# EAGLE design guest room controller V1 (EAGLE 7.2.0)
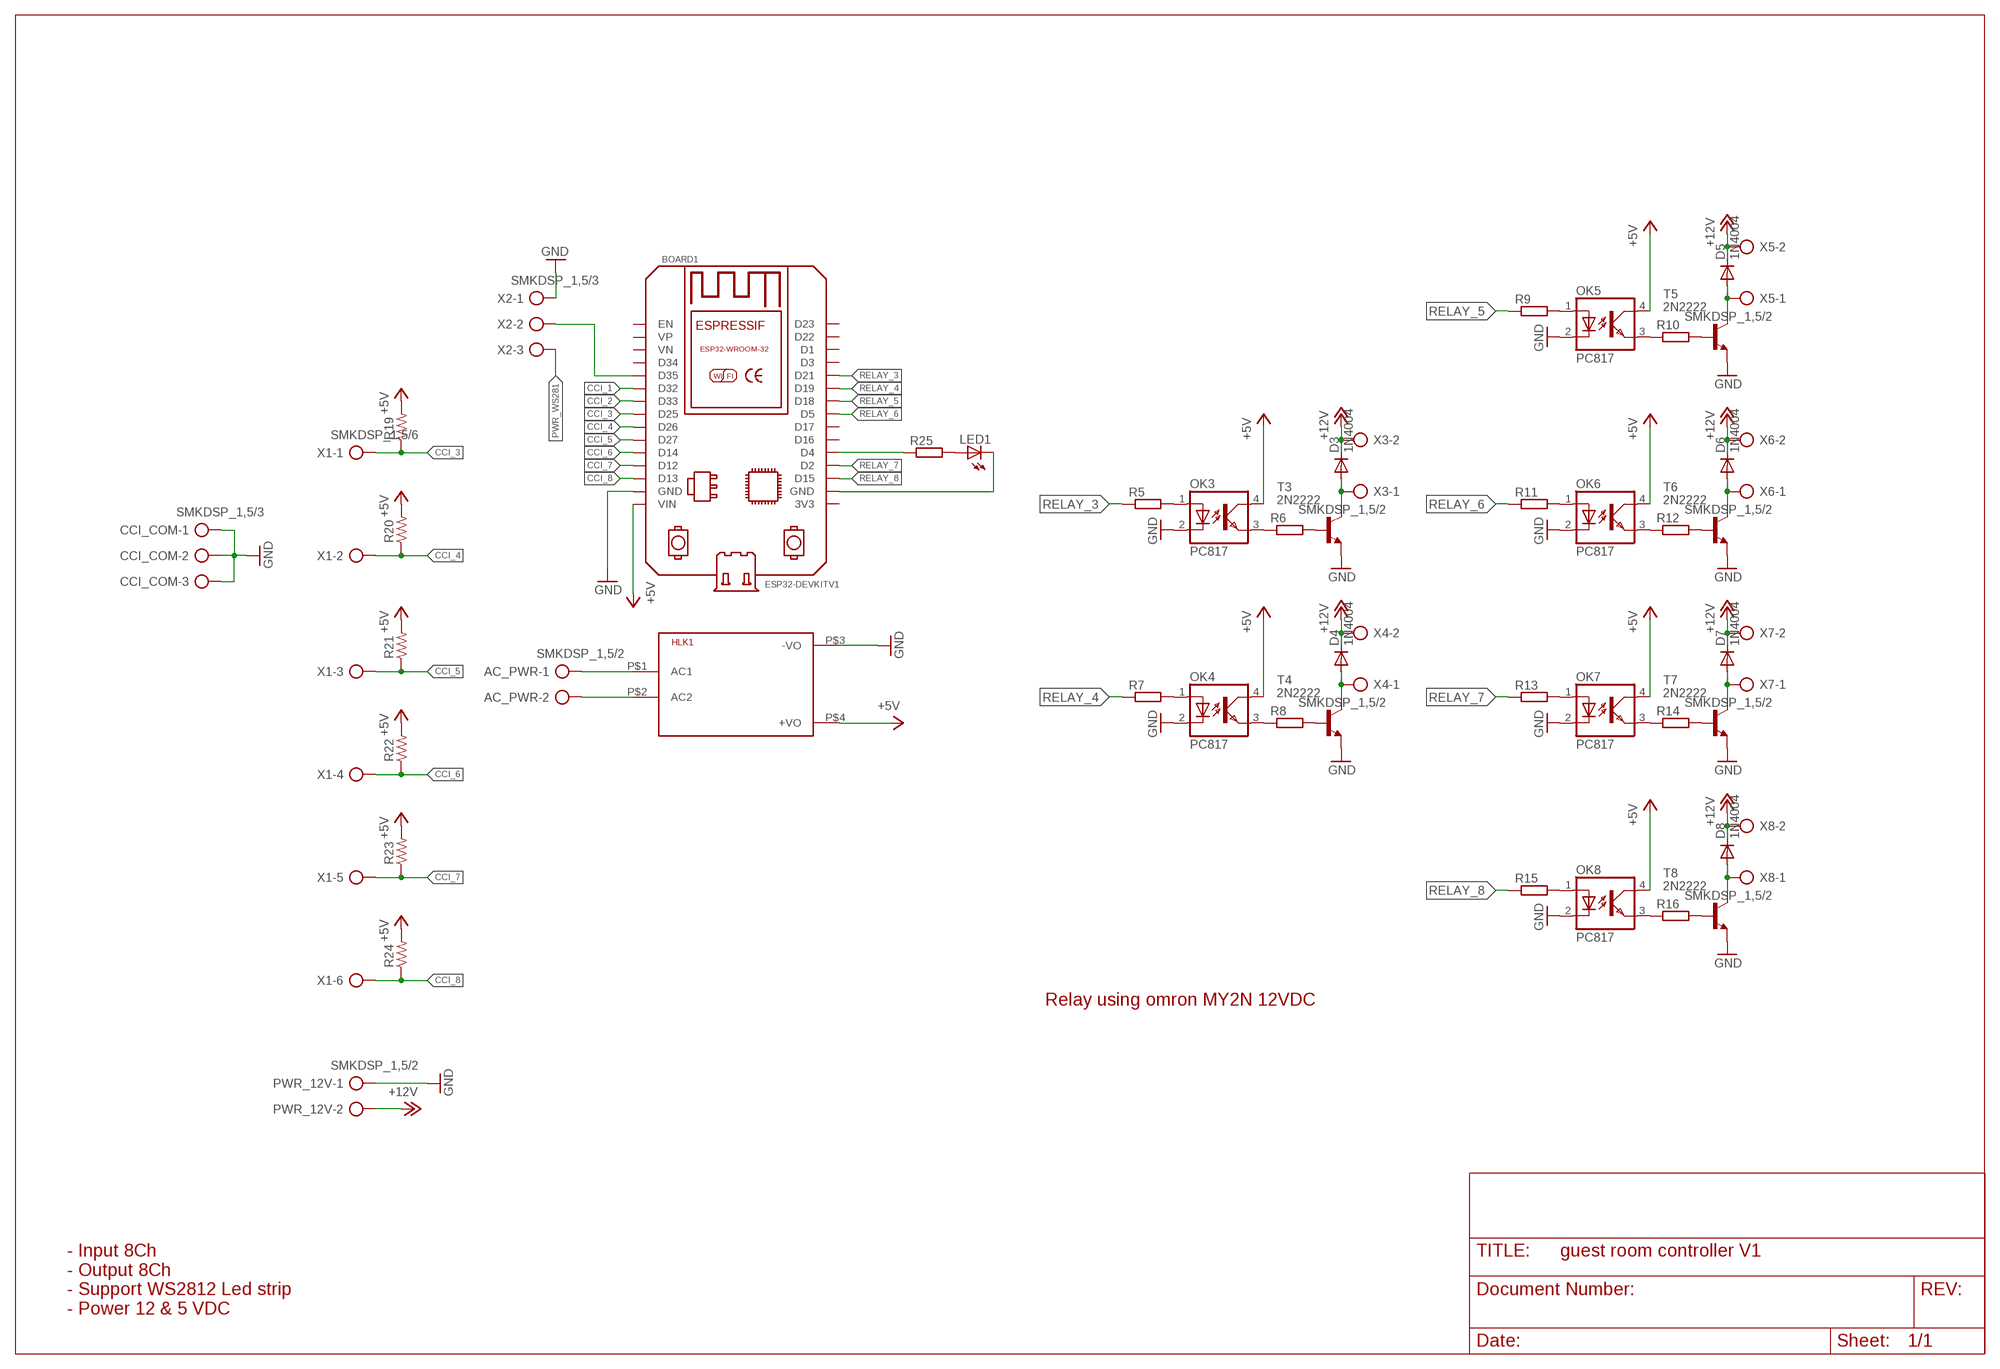
[diagram p0: schematic, sheet 1]

## Parts
AC_PWR  SMKDSP_1,5/2  [SMKDSP_1,5/2]
BOARD1  ESP32DEVKITV1  [ESP32-DEVKITV1]
CCI_COM  SMKDSP_1,5/3  [SMKDSP_1,5/3]
D3  1N4004  [DO41-10]
D4  1N4004  [DO41-10]
D5  1N4004  [DO41-10]
D6  1N4004  [DO41-10]
D7  1N4004  [DO41-10]
D8  1N4004  [DO41-10]
HLK1  HLK-PM013W  [HLK-PM01]
LED1  LED3MM  [LED3MM]
OK3  PC817  [DIL04]
OK4  PC817  [DIL04]
OK5  PC817  [DIL04]
OK6  PC817  [DIL04]
OK7  PC817  [DIL04]
OK8  PC817  [DIL04]
PWR_12V  SMKDSP_1,5/2  [SMKDSP_1,5/2]
R5  R-EU_0207/10  [0207/10]
R6  R-EU_0207/10  [0207/10]
R7  R-EU_0207/10  [0207/10]
R8  R-EU_0207/10  [0207/10]
R9  R-EU_0207/10  [0207/10]
R10  R-EU_0207/10  [0207/10]
R11  R-EU_0207/10  [0207/10]
R12  R-EU_0207/10  [0207/10]
R13  R-EU_0207/10  [0207/10]
R14  R-EU_0207/10  [0207/10]
R15  R-EU_0207/10  [0207/10]
R16  R-EU_0207/10  [0207/10]
R19  R_1206  [R1206]
R20  R_1206  [R1206]
R21  R_1206  [R1206]
R22  R_1206  [R1206]
R23  R_1206  [R1206]
R24  R_1206  [R1206]
R25  R-EU_0207/10  [0207/10]
T3  2N2222  [TO18]
T4  2N2222  [TO18]
T5  2N2222  [TO18]
T6  2N2222  [TO18]
T7  2N2222  [TO18]
T8  2N2222  [TO18]
X1  SMKDSP_1,5/6  [SMKDSP_1,5/6]
X2  SMKDSP_1,5/3  [SMKDSP_1,5/3]
X3  SMKDSP_1,5/2  [SMKDSP_1,5/2]
X4  SMKDSP_1,5/2  [SMKDSP_1,5/2]
X5  SMKDSP_1,5/2  [SMKDSP_1,5/2]
X6  SMKDSP_1,5/2  [SMKDSP_1,5/2]
X7  SMKDSP_1,5/2  [SMKDSP_1,5/2]
X8  SMKDSP_1,5/2  [SMKDSP_1,5/2]

## Nets
+5V: BOARD1.VIN HLK1.P$4(+VO) OK3.4(COL) OK4.4(COL) OK5.4(COL) OK6.4(COL) OK7.4(COL) OK8.4(COL) R19.2 R20.2 R21.2 R22.2 R23.2 R24.2
+12V: D3.C D4.C D5.C D6.C D7.C D8.C PWR_12V.2 X3.2 X4.2 X5.2 X6.2 X7.2 X8.2
CCI_1: BOARD1.D32
CCI_2: BOARD1.D33
CCI_3: BOARD1.D25 R19.1 X1.1
CCI_4: BOARD1.D26 R20.1 X1.2
CCI_5: BOARD1.D27 R21.1 X1.3
CCI_6: BOARD1.D14 R22.1 X1.4
CCI_7: BOARD1.D12 R23.1 X1.5
CCI_8: BOARD1.D13 R24.1 X1.6
GND: BOARD1.GND CCI_COM.1 CCI_COM.2 CCI_COM.3 HLK1.P$3(-VO) OK3.2(C) OK4.2(C) OK5.2(C) OK6.2(C) OK7.2(C) OK8.2(C) PWR_12V.1 T3.1(E) T4.1(E) T5.1(E) T6.1(E) T7.1(E) T8.1(E) X2.1
N$7: OK3.3(EMIT) R6.1
N$8: R6.2 T3.2(B)
N$9: D3.A T3.3(C) X3.1
N$10: OK4.3(EMIT) R8.1
N$11: R8.2 T4.2(B)
N$12: D4.A T4.3(C) X4.1
N$13: OK5.3(EMIT) R10.1
N$14: R10.2 T5.2(B)
N$15: D5.A T5.3(C) X5.1
N$16: OK6.3(EMIT) R12.1
N$17: R12.2 T6.2(B)
N$18: D6.A T6.3(C) X6.1
N$19: OK7.3(EMIT) R14.1
N$20: R14.2 T7.2(B)
N$21: D7.A T7.3(C) X7.1
N$22: OK8.3(EMIT) R16.1
N$23: R16.2 T8.2(B)
N$24: D8.A T8.3(C) X8.1
N$25: AC_PWR.1 HLK1.P$1(AC1)
N$28: OK3.1(A) R5.2
N$29: OK4.1(A) R7.2
N$30: OK5.1(A) R9.2
N$31: OK6.1(A) R11.2
N$32: OK7.1(A) R13.2
N$33: OK8.1(A) R15.2
N$35: BOARD1.D4 R25.1
N$36: LED1.A R25.2
N$37: BOARD1.GND@1(GND) LED1.K(C)
N$38: BOARD1.D35 X2.2
N$39: AC_PWR.2 HLK1.P$2(AC2)
PWR_WS281: X2.3
RELAY_3: BOARD1.D21 R5.1
RELAY_4: BOARD1.D19 R7.1
RELAY_5: BOARD1.D18 R9.1
RELAY_6: BOARD1.D5 R11.1
RELAY_7: BOARD1.D2 R13.1
RELAY_8: BOARD1.D15 R15.1
Unconnected: BOARD1.3V3 BOARD1.D1 BOARD1.D3 BOARD1.D16 BOARD1.D17 BOARD1.D22 BOARD1.D23 BOARD1.D34 BOARD1.EN BOARD1.VN BOARD1.VP

## Notes on the sheet
- Relay using omron MY2N 12VDC
- - Input 8Ch
  - Output 8Ch
  - Support WS2812 Led strip
  - Power 12 & 5 VDC

## Library data of the parts
AC_PWR PWR_12V X3-X8 = con-phoenix-smkdsp:SMKDSP_1,5/2: Printklemme, Nennstrom: 17,5 A, Bemessungsspannung: 250 V, Raster: 5,0 mm Source: http://eshop.phoenixcontact.de .. 1733415.pdf; MF: FARNELL; MPN: 1733570; OC_FARNELL: 3041244; OC_NEWARK: 69C8588
BOARD1 = ESP32-DEVKITV1:ESP32DEVKITV1: https://github.com/shridattdudhat
CCI_COM X2 = con-phoenix-smkdsp:SMKDSP_1,5/3: Printklemme, Nennstrom: 17,5 A, Bemessungsspannung: 250 V, Raster: 5,0 mm Source: http://eshop.phoenixcontact.de .. 1733415.pdf; MF: FARNELL; MPN: 1733583; OC_FARNELL: 3041256; OC_NEWARK: 71C4130
D3-D8 = diode:1N4004: DIODE general purpose rectifier, 1 A
HLK1 = HLK-PM01:HLK-PM01: Hi-Link Power Supply HLK-PM01 3W Author: Ahmed Said <https://github.com/AhmedSaid/EAGLELibraries>
LED1 = led:LED: LED OSRAM: - CHIPLED LG R971, LG N971, LY N971, LG Q971, LY Q971, LO R971, LY R971 LH N974, LH R974 LS Q976, LO Q976, LY Q976 LO Q996 - Hyper CHIPLED LW Q18S LB Q993, LB Q99A, LB R99A - SideLED LS A670, LO A670, LY A670, LG A670, LP A670 LB A673, LV A673, LT A673, LW A673 LH A674 LY A675 LS A676, LA A676, LO A676, LY A676, LW A676 LS A679, LY A679, LG A679 - Hyper Micro SIDELED® LS Y876, LA Y876, LO Y876, LY Y876 LT Y87S - SmartLED LW L88C, LW L88S LB L89C, LB L89S, LG L890 LS L89K, LO L89K, LY L89K LS L896, LA L896, LO L896, LY L896 - TOPLED LS T670, LO T670, LY T670, LG T670, LP T670 LSG T670, LSP T670, LSY T670, LOP T670, LYG T670 LG T671, LOG T671, LSG T671 LB T673, LV T673, LT T673, LW T673 LH T674 LS T676, LA T676, LO T676, LY T676, LB T676, LH T676, LSB T676, LW T676 LB T67C, LV T67C, LT T67C, LS T67K, LO T67K, LY T67K, LW E67C LS E67B, LA E67B, LO E67B, LY E67B, LB E67C, LV E67C, LT E67C LW T67C LS T679, LY T679, LG T679 LS T770, LO T770, LY T770, LG T770, LP T770 LB T773, LV T773, LT T773, LW T773 LH T774 LS E675, LA E675, LY E675, LS T675 LS T776, LA T776, LO T776, LY T776, LB T776 LHGB T686 LT T68C, LB T68C - Hyper Mini TOPLED® LB M676 - Mini TOPLED Santana® LG M470 LS M47K, LO M47K, LY M47K Source: http://www.osram.convergy.de LUXEON: - LUMILED® LXK2-PW12-R00, LXK2-PW12-S00, LXK2-PW14-U00, LXK2-PW14-V00 LXK2-PM12-R00, LXK2-PM12-S00, LXK2-PM14-U00 LXK2-PE12-Q00, LXK2-PE12-R00, LXK2-PE12-S00, LXK2-PE14-T00, LXK2-PE14-U00 LXK2-PB12-K00, LXK2-PB12-L00, LXK2-PB12-M00, LXK2-PB14-N00, LXK2-PB14-P00, LXK2-PB14-Q00 LXK2-PR12-L00, LXK2-PR12-M00, LXK2-PR14-Q00, LXK2-PR14-R00 LXK2-PD12-Q00, LXK2-PD12-R00, LXK2-PD12-S00 LXK2-PH12-R00, LXK2-PH12-S00 LXK2-PL12-P00, LXK2-PL12-Q00, LXK2-PL12-R00 Source: www.luxeon.com KINGBRIGHT: KA-3528ASYC Source: www.kingbright.com
OK3-OK8 = optocoupler:PC817: SHARP OPTO COUPLER; MPN: PC817X4J000F; OC_FARNELL: 9707727; OC_NEWARK: 97K7059
R5-R16 R25 = resistor:R-EU_: RESISTOR, European symbol
R19-R24 = rc-master-smd:R_: RESISTOR
T3-T8 = transistor:2N2222: NPN TRANSISTOR
X1 = con-phoenix-smkdsp:SMKDSP_1,5/6: Printklemme, Nennstrom: 17,5 A, Bemessungsspannung: 250 V, Raster: 5,0 mm Source: http://eshop.phoenixcontact.de .. 1733415.pdf; MF: FARNELL; MPN: 1733619; OC_FARNELL: 3041270; OC_NEWARK: 71C4132

## Board
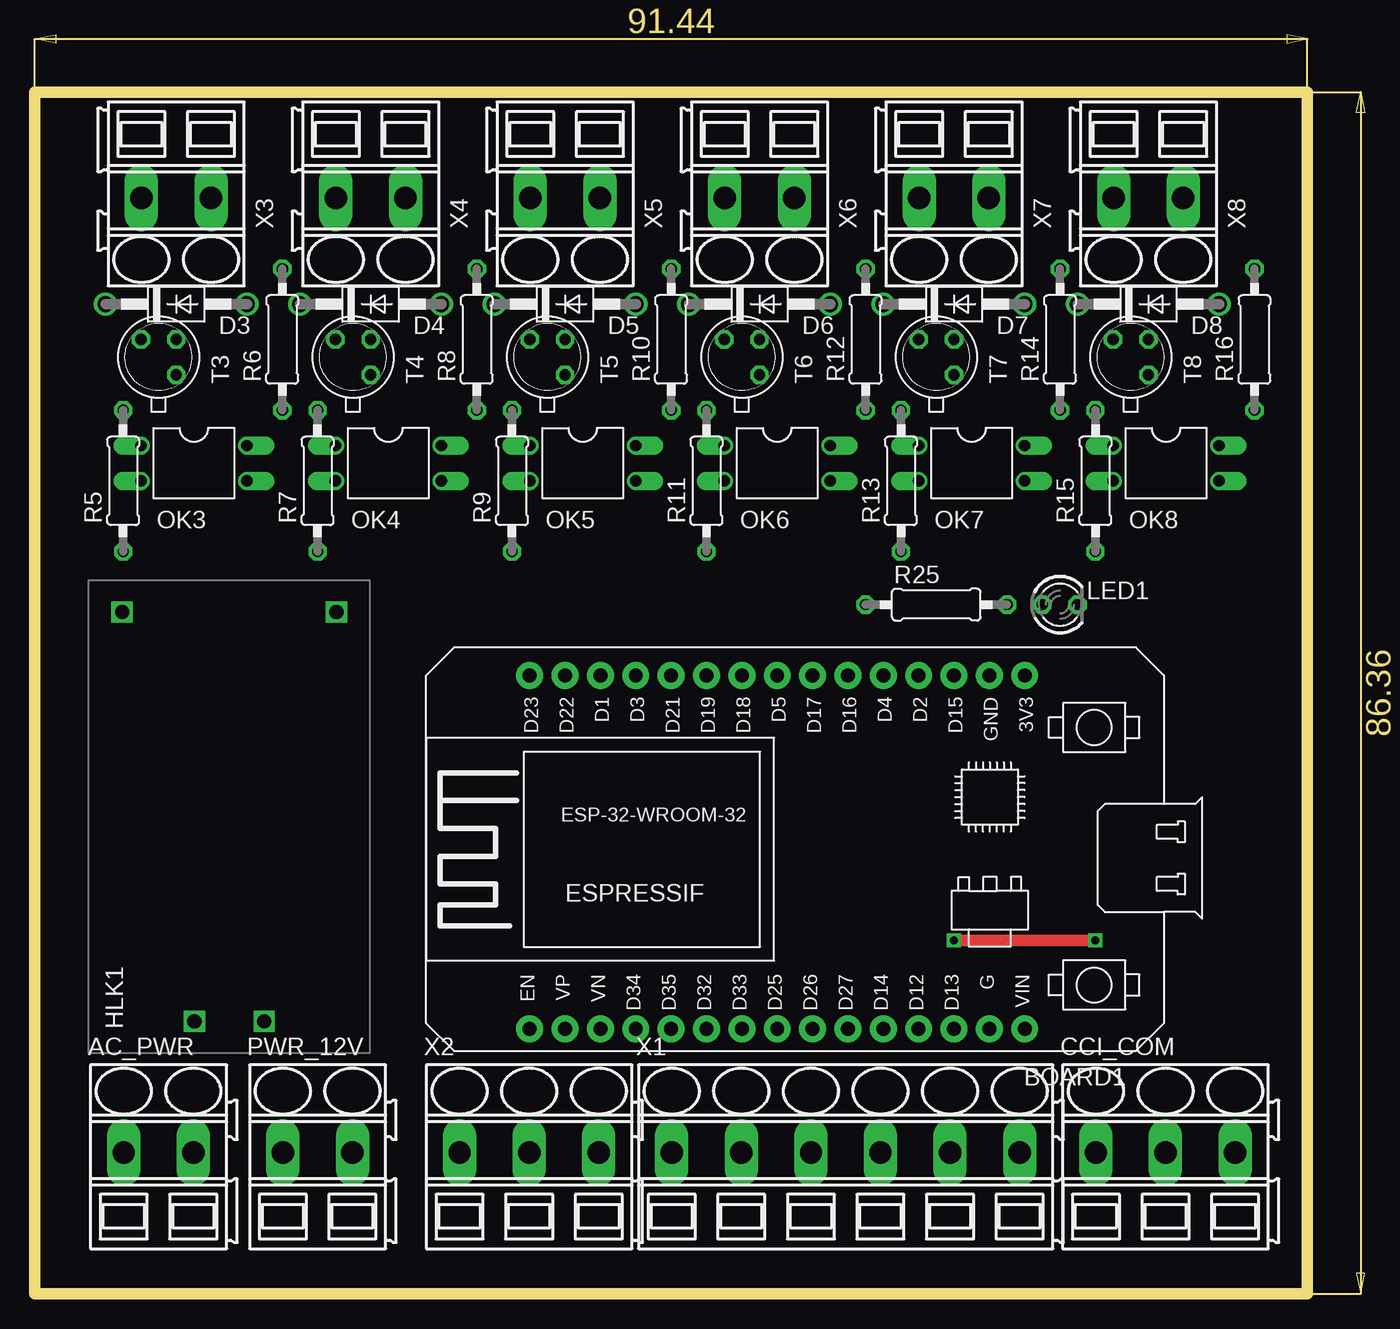
[diagram p1: board, top side]
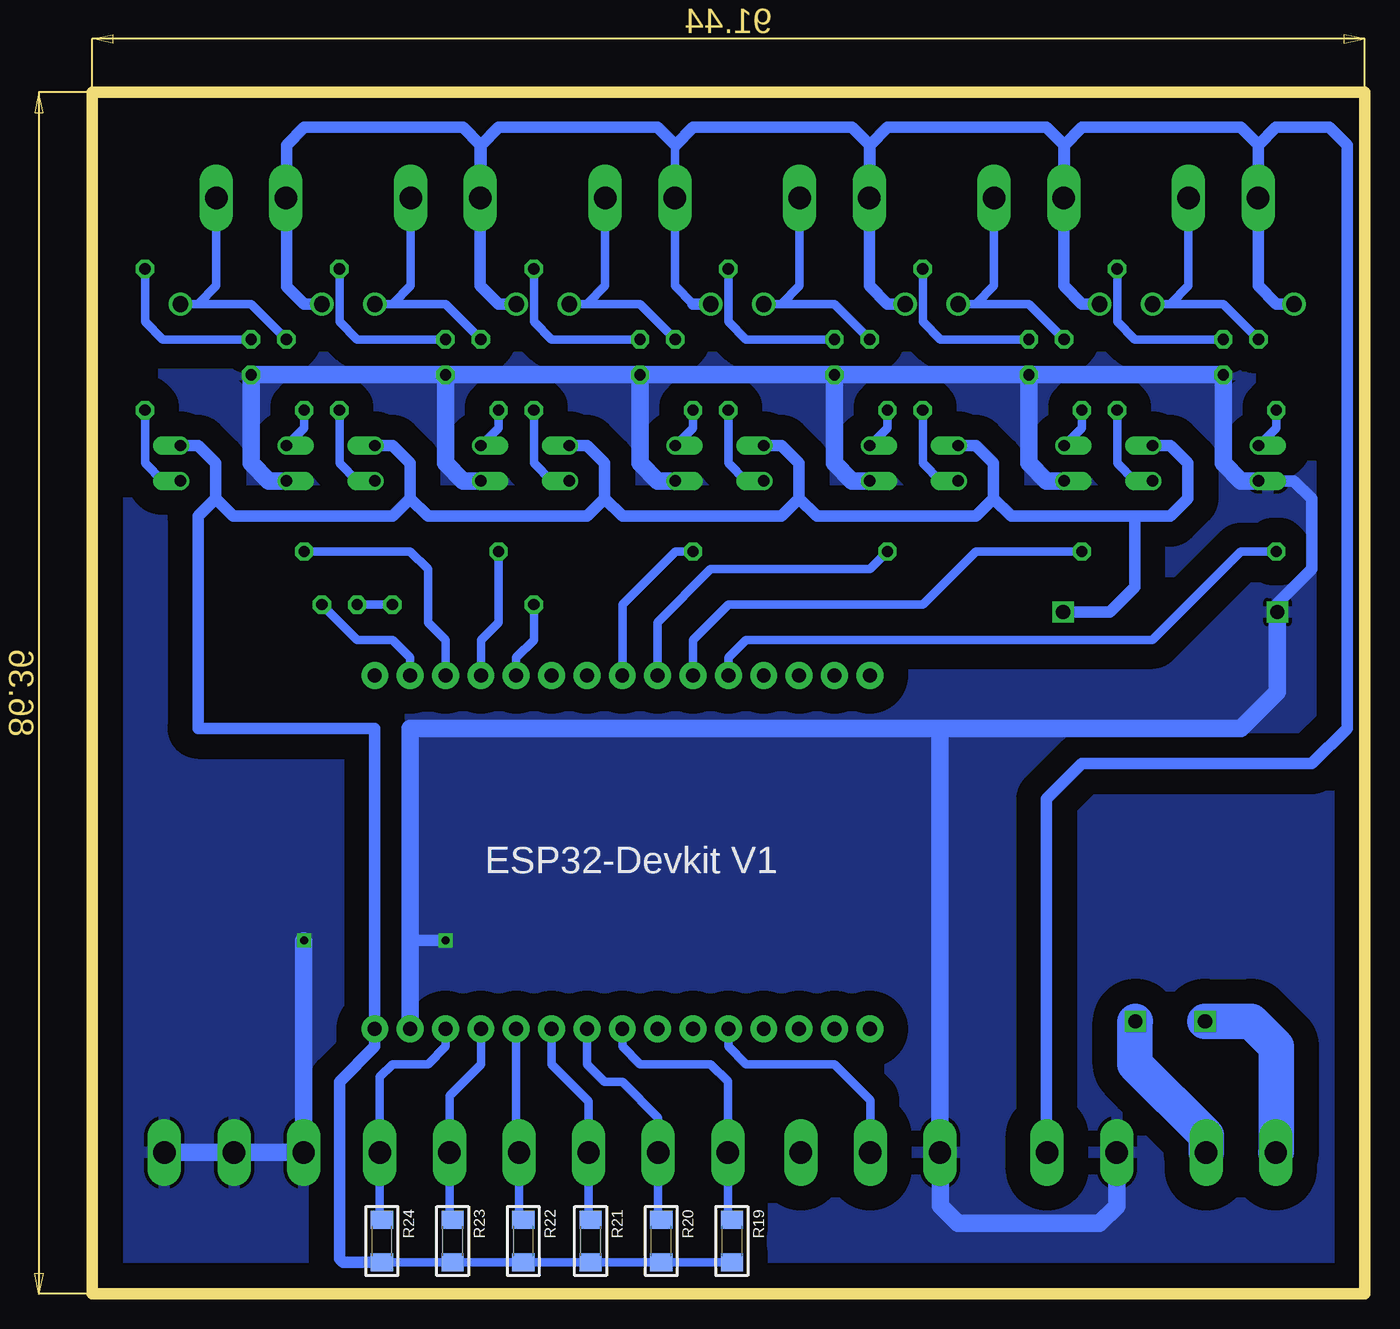
[diagram p2: board, bottom side, seen from below]

Size 91.44 x 86.36 mm. Coordinates in mm from the lower left corner, seen from the top.
Outline: 0,86.36 91.44,86.36 91.44,0 0,0 0,86.36
Copper layers (1*16): Top 0.035mm / dielectric 1.5mm / Bottom 0.035mm
Design rules "default": minimum track width 10mil, minimum drill 24mil, track to track 8mil, track to pad 8mil, pad to pad 8mil, via to via 8mil, smd to smd 8mil, copper to edge 40mil, drill to drill 8mil, minimum pad ring 10mil, minimum via ring 8mil, stop-mask expansion 4mil, vias tented up to drill 0mil, thermal gap 10mil

### Footprints (pad centres in the part's own frame; a part is rotated, then mirrored left to right if it is on the bottom)
SMKDSP_1,5/2 = drill 1.6 pad 1.8 long: 1 -2.5,0; 2 2.5,0
ESP32-DEVKITV1 = drill 1 pad 1.93: 3V3 0,0; D1 30.48,0; D2 7.62,0; D3 27.94,0; D4 10.16,0; D5 17.78,0; D12 7.62,25.4; D13 5.08,25.4; D14 10.16,25.4; D15 5.08,0; D16 12.7,0; D17 15.24,0; D18 20.32,0; D19 22.86,0; D21 25.4,0; D22 33.02,0; D23 35.56,0; D25 17.78,25.4; D26 15.24,25.4; D27 12.7,25.4; D32 22.86,25.4; D33 20.32,25.4; D34 27.94,25.4; D35 25.4,25.4; EN 35.56,25.4; GND 2.54,25.4; GND@1 2.54,0; VIN 0,25.4; VN 30.48,25.4; VP 33.02,25.4
SMKDSP_1,5/3 = drill 1.6 pad 1.8 long: 1 -2.5,0; 2 2.5,0; 3 7.5,0
DO41-10 = drill 1.118: A 5.08,0; C -5.08,0
HLK-PM01 = drill 1.016 square: P$1 -14.7,2.5; P$2 -14.7,-2.5; P$3 14.7,7.7; P$4 14.7,-7.7
LED3MM = drill 0.813 octagon: A -1.27,0; K 1.27,0
DIL04 = drill 0.813 offset: 1 -1.27,-3.81; 2 1.27,-3.81; 3 1.27,3.81; 4 -1.27,3.81
0207/10 = drill 0.813 octagon: 1 -5.08,0; 2 5.08,0
R1206 = smd 1.3 x 1.6: 1 -1.524,0; 2 1.524,0
TO18 = drill 0.813 octagon: 1 -1.27,-1.27; 2 1.27,-1.27; 3 1.27,1.27
SMKDSP_1,5/6 = drill 1.6 pad 1.8 long: 1 -2.5,0; 2 2.5,0; 3 7.5,0; 4 12.5,0; 5 17.5,0; 6 22.5,0

### Placement (x,y rotation side)
AC_PWR  8.89,10.16 0 top
BOARD1  71.12,44.45 180 top
CCI_COM  78.74,10.16 0 top
D3  10.16,71.12 0 top
D4  24.13,71.12 0 top
D5  38.1,71.12 0 top
D6  52.07,71.12 0 top
D7  66.04,71.12 0 top
D8  80.01,71.12 0 top
HLK1  13.97,34.29 90 top
LED1  73.66,49.53 0 top
OK3  11.43,59.69 270 top
OK4  25.4,59.69 270 top
OK5  39.37,59.69 270 top
OK6  53.34,59.69 270 top
OK7  67.31,59.69 270 top
OK8  81.28,59.69 270 top
PWR_12V  20.32,10.16 0 top
R5  6.35,58.42 90 top
R6  17.78,68.58 90 top
R7  20.32,58.42 90 top
R8  31.75,68.58 90 top
R9  34.29,58.42 90 top
R10  45.72,68.58 90 top
R11  48.26,58.42 90 top
R12  59.69,68.58 90 top
R13  62.23,58.42 90 top
R14  73.66,68.58 90 top
R15  76.2,58.42 90 top
R16  87.63,68.58 90 top
R19  45.47,3.81 270 bottom
R20  50.55,3.81 270 bottom
R21  55.63,3.81 270 bottom
R22  60.45,3.81 270 bottom
R23  65.53,3.81 270 bottom
R24  70.61,3.81 270 bottom
R25  64.77,49.53 0 top
T3  8.89,67.31 90 top
T4  22.86,67.31 90 top
T5  36.83,67.31 90 top
T6  50.8,67.31 90 top
T7  64.77,67.31 90 top
T8  78.74,67.31 90 top
X1  48.26,10.16 0 top
X2  33.02,10.16 0 top
X3  10.16,78.74 180 top
X4  24.13,78.74 180 top
X5  38.1,78.74 180 top
X6  52.07,78.74 180 top
X7  66.04,78.74 180 top
X8  80.01,78.74 180 top

### Tracks (layer width: path | path; a pad name or v marks a point on that pad's centre or on a via)
+5V
  Bottom 0.61: R24.2 R23.2 R22.2 R21.2 R20.2 R19.2
  Bottom 0.813: OK8.4 83.82,60.96 82.55,59.69 82.55,57.15 | 68.58,57.15 69.85,55.88 81.28,55.88 82.55,57.15 | 68.58,57.15 68.58,59.69 69.85,60.96 OK7.4 | OK6.4 55.88,60.96 54.61,59.69 54.61,57.15 | 54.61,57.15 55.88,55.88 67.31,55.88 68.58,57.15 | OK5.4 41.91,60.96 40.64,59.69 40.64,57.15 | 40.64,57.15 41.91,55.88 53.34,55.88 54.61,57.15 | OK4.4 27.94,60.96 26.67,59.69 26.67,57.15 | 26.67,57.15 27.94,55.88 39.37,55.88 40.64,57.15 | OK3.4 13.97,60.96 12.7,59.69 12.7,57.15 13.97,55.88 16.51,55.88 | 16.51,55.88 25.4,55.88 26.67,57.15 | HLK1.P$4 18.32,48.99 16.51,50.8 16.51,55.88 | 82.55,57.15 83.82,55.88 83.82,40.64 71.12,40.64 BOARD1.VIN 71.12,17.78 73.66,15.24 73.66,2.54 73.41,2.29 R24.2
+12V
  Bottom 0.61: 49.53,82.55 49.57,82.51 X6.2 49.57,72.43 48.26,71.12
  Bottom 0.813: 7.66,82.55 X3.2 7.66,72.43 6.35,71.12 D3.C | 7.66,82.55 7.66,82.59 8.89,83.82 20.32,83.82 21.59,82.55 21.59,78.78 X4.2 | X4.2 21.63,82.59 22.86,83.82 34.29,83.82 35.56,82.55 35.56,78.78 X5.2 | X5.2 35.6,82.59 36.83,83.82 48.26,83.82 49.53,82.55 50.8,83.82 62.23,83.82 63.5,82.55 63.5,78.78 X7.2 | X7.2 63.54,82.59 64.77,83.82 76.2,83.82 77.47,82.55 77.47,78.74 | 77.47,78.74 X8.2 | 77.47,78.74 77.47,72.39 76.2,71.12 D8.C | X4.2 21.63,72.43 20.32,71.12 D4.C | X5.2 35.6,72.43 34.29,71.12 D5.C | 48.26,71.12 D6.C | X7.2 63.54,72.43 62.23,71.12 D7.C | 7.66,82.55 6.39,83.82 2.54,83.82 1.27,82.55 1.27,40.64 3.81,38.1 20.32,38.1 22.86,35.56 22.86,10.2 PWR_12V.2
CCI_3
  Bottom 0.61: BOARD1.D25 53.34,17.78 52.07,16.51 46.99,16.51 45.76,15.28 X1.1 45.76,5.63 R19.1
CCI_4
  Bottom 0.61: BOARD1.D26 55.88,16.51 54.61,15.24 53.34,15.24 50.76,12.66 X1.2 50.76,5.12 | 50.76,5.12 50.8,5.08 | 50.76,5.12 R20.1
CCI_5
  Bottom 0.61: BOARD1.D27 58.42,16.51 55.76,13.85 X1.3 55.76,5.47 R21.1
CCI_6
  Bottom 0.61: BOARD1.D14 60.96,10.36 X1.4 60.76,5.64 R22.1
CCI_7
  Bottom 0.61: BOARD1.D12 63.5,16.51 65.76,14.25 X1.5 65.76,5.56 R23.1
CCI_8
  Bottom 0.61: BOARD1.D13 66.04,17.78 67.31,16.51 69.85,16.51 70.76,15.6 X1.6 70.76,5.48 R24.1
GND  (via drill 0.6)
  Top 0.813: v76.2,25.4 v66.04,25.4
  Bottom 0.813: 76.24,25.36 v76.2,25.4 | v66.04,25.4 68.58,25.4 | HLK1.P$3 6.27,49.61 3.81,52.07 3.81,57.15 5.08,58.42 8.89,58.42
  Bottom 1.27: T7.1 T8.1 80.01,59.69 78.74,58.42 OK8.2 | T7.1 T6.1 | T6.1 T5.1 | T5.1 T4.1 | T4.1 T3.1 10.16,59.69 8.89,58.42 OK3.2 | OK7.2 64.77,58.42 66.04,59.69 T7.1 | OK6.2 50.8,58.42 52.07,59.69 T6.1 | OK5.2 36.83,58.42 38.1,59.69 T5.1 | OK4.2 22.86,58.42 24.13,59.69 T4.1 | 30.48,40.64 8.89,40.64 6.27,43.26 HLK1.P$3 | 30.48,40.64 68.58,40.64 68.58,25.4 BOARD1.GND | 30.48,40.64 30.52,40.6 X2.1 30.48,10.12 30.48,6.35 29.21,5.08 19.05,5.08 17.82,6.31 PWR_12V.1 | 76.24,25.36 CCI_COM.1 CCI_COM.2 CCI_COM.3
  pour Bottom (isolate 1.778): 0,86.36 91.44,86.36 91.44,0 0,0
N$7
  Bottom 0.61: R6.1 17.78,59.69 16.51,58.42 OK3.3
N$8
  Bottom 0.61: T3.2 16.51,68.58 17.78,69.85 R6.2
N$9
  Bottom 0.61: T3.3 10.16,71.12 13.97,71.12 | 13.97,71.12 D3.A | X3.1 12.66,72.43 13.97,71.12
N$10
  Bottom 0.61: R8.1 31.75,59.69 30.48,58.42 OK4.3
N$11
  Bottom 0.61: T4.2 30.48,68.58 31.75,69.85 R8.2
N$12
  Bottom 0.61: X4.1 26.63,72.43 27.94,71.12 D4.A 24.13,71.12 T4.3
N$13
  Bottom 0.61: R10.1 45.72,59.69 44.45,58.42 OK5.3
N$14
  Bottom 0.61: T5.2 44.45,68.58 45.72,69.85 R10.2
N$15
  Bottom 0.61: T5.3 38.1,71.12 41.91,71.12 | 41.91,71.12 D5.A | X5.1 40.6,72.43 41.91,71.12
N$16
  Bottom 0.61: R12.1 59.69,59.69 58.42,58.42 OK6.3
N$17
  Bottom 0.61: T6.2 58.42,68.58 59.69,69.85 R12.2
N$18
  Bottom 0.61: T6.3 52.07,71.12 55.88,71.12 | 55.88,71.12 D6.A | X6.1 54.57,72.43 55.88,71.12
N$19
  Bottom 0.61: R14.1 73.66,59.69 72.39,58.42 OK7.3
N$20
  Bottom 0.61: T7.2 72.39,68.58 73.66,69.85 R14.2
N$21
  Bottom 0.61: T7.3 66.04,71.12 69.85,71.12 | 69.85,71.12 D7.A | X7.1 68.54,72.43 69.85,71.12
N$22
  Bottom 0.61: R16.1 87.63,59.69 86.36,58.42 OK8.3
N$23
  Bottom 0.61: R16.2 87.63,69.85 86.36,68.58 T8.2
N$24
  Bottom 0.61: T8.3 80.01,71.12 83.82,71.12 | 83.82,71.12 D8.A | X8.1 82.51,72.43 83.82,71.12
N$25
  Bottom 2.54: HLK1.P$1 8.16,19.59 6.35,17.78 6.35,10.2 AC_PWR.1
N$28
  Bottom 0.61: R5.2 6.35,62.23 OK3.1
N$29
  Bottom 0.61: R7.2 20.32,62.23 OK4.1
N$30
  Bottom 0.61: R9.2 34.29,62.23 OK5.1
N$31
  Bottom 0.61: R11.2 48.26,62.23 OK6.1
N$32
  Bottom 0.61: R13.2 62.23,62.23 OK7.1
N$33
  Bottom 0.61: R15.2 76.2,62.23 OK8.1
N$35
  Bottom 0.61: BOARD1.D4 60.96,45.72 59.69,46.99 R25.1
N$36
  Bottom 0.61: LED1.A R25.2
N$37
  Bottom 0.61: BOARD1.GND@1 68.58,45.72 69.85,46.99 72.39,46.99 LED1.K
N$38
  Bottom 0.61: X2.2 35.52,13.93 38.1,16.51 44.45,16.51 45.72,17.78 BOARD1.D35
N$39
  Bottom 2.54: AC_PWR.2 11.39,11.39 16.51,16.51 16.51,19.55 HLK1.P$2
RELAY_3
  Bottom 0.61: BOARD1.D21 45.72,45.72 44.45,46.99 15.24,46.99 8.89,53.34 R5.1
RELAY_4
  Bottom 0.61: BOARD1.D19 48.26,46.99 45.72,49.53 31.75,49.53 27.94,53.34 R7.1
RELAY_5
  Bottom 0.61: BOARD1.D18 50.8,48.26 46.99,52.07 35.56,52.07 R9.1
RELAY_6
  Bottom 0.61: BOARD1.D5 53.34,49.53 49.53,53.34 R11.1
RELAY_7
  Bottom 0.61: BOARD1.D2 63.5,46.99 62.23,48.26 R13.1
RELAY_8
  Bottom 0.61: BOARD1.D15 66.04,46.99 67.31,48.26 67.31,52.07 68.58,53.34 R15.1